# Altium project BH1730FVC_panel.PrjPcb
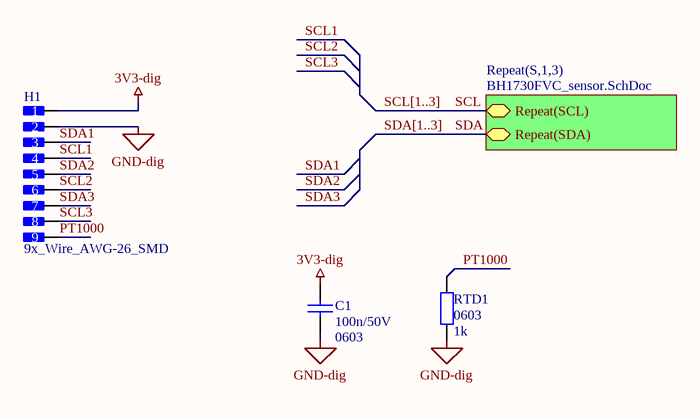
[diagram p0: BH1730FVC_top.SchDoc]
2 sheets, 6 parts. Net scope: hierarchical (ports join the sheet entries above them; power ports are global).
Board files: BH1730FVC_panel_with_PT1000_PCB.PcbDoc, BH1730FVC_panel_PCB.PcbDoc
Sheets:
  BH1730FVC_top.SchDoc
    S1 = BH1730FVC_sensor.SchDoc
    S2 = BH1730FVC_sensor.SchDoc
    S3 = BH1730FVC_sensor.SchDoc

## Sheet BH1730FVC_top.SchDoc: Electrical Power System - General Block Diagram
size A4; Date: 2015-02-21; CheckedBy: Piotr Kuligowski; Author: Michał Gumiela; DocumentNumber: 1; Revision: 1-0; SheetNumber: 1; SheetTotal: 2; Model: DM1; PageSetup: Record=PageOptions|CenterHorizontal=True|CenterVertical=True|PrintScale=0.52|XCorrection=1.00|YCorrection=1.00|PrintKind=1|BorderSize=5000000|LeftOffset=0|BottomOffset=0|Orientation=2|PaperLength=4200|PaperWidth=2970|Scale=100|PaperSource=7|PrintQuality=600|MediaType=1|DitherType=10|PaperKind=A3|PrintScaleMode=1

### Parts
C1  Package: 0603  [SMD_Capacitor_0603]  (hidden comment: 100n/50V)
H1  9x_Wire_AWG-26_SMD  [Wire_AWG-26_x9_SMD]
RTD1  Package: 0603  [SMD_Resistor_0603]  (hidden comment: 1k)

### Sub-sheets
Repeat(S,1,3) = BH1730FVC_sensor.SchDoc: Repeat(SCL) (bidir), Repeat(SDA) (bidir)

### Nets
3V3-dig: C1.1 H1.1
GND-dig: C1.2 H1.2 RTD1.2
PT1000: H1.9 RTD1.1
SCL: sheet Repeat(S,1,3)/Repeat(SCL)
SCL1: H1.4
SCL2: H1.6
SCL3: H1.8
SDA: sheet Repeat(S,1,3)/Repeat(SDA)
SDA1: H1.3
SDA2: H1.5
SDA3: H1.7

### Buses and harness runs
bus SCL[1..3]
bus SDA[1..3]

### Notes on the sheet
- Title:
- Sheet:
- of
- Author:
- Model:
- Document Number:
- Checked by:
- Iss-Rev:
- Approved by:
- Date:
- File name:

### Library data of the parts
C1 = Cer_C0603T104K5RALTU: Ceramic Cap Kemet COTS 100n/50V X7R 0603; Manufacturer: Kemet; ManufacturerPartNumber: C0603T104K5RALTU; Value: 100n/50V
H1 = Wire_AWG-26_x9_SMD_1: 9 x SMD pads for an AWG-26 wire with stress relief, pitch 1.27mm.; Value: 9x_Wire_AWG-26_SMD
RTD1 = PTS060301B100RP100: PT1000 Vishay PTS060301B100RP100; Manufacturer: Vishay; ManufacturerPartNumber: PTS060301B100RP100; Value: 1k

## Sheet BH1730FVC_sensor.SchDoc: BH1730FVC sensor sheet
size A4; Date: 2015-02-21; CheckedBy: Piotr Kuligowski; Author: Michał Gumiela; DocumentNumber: 2; Revision: 1-0; SheetNumber: 2; SheetTotal: 2; Model: DM1; PageSetup: Record=PageOptions|CenterHorizontal=True|CenterVertical=True|PrintScale=0.52|XCorrection=1.00|YCorrection=1.00|PrintKind=1|BorderSize=5000000|LeftOffset=0|BottomOffset=0|Orientation=2|PaperLength=4200|PaperWidth=2970|Scale=100|PaperSource=7|PrintQuality=600|MediaType=1|DitherType=10|PaperKind=A3|PrintScaleMode=1
Used 3 times, as channels S1, S2, S3. Parts and nets are listed once, with the designators drawn on the sheet.
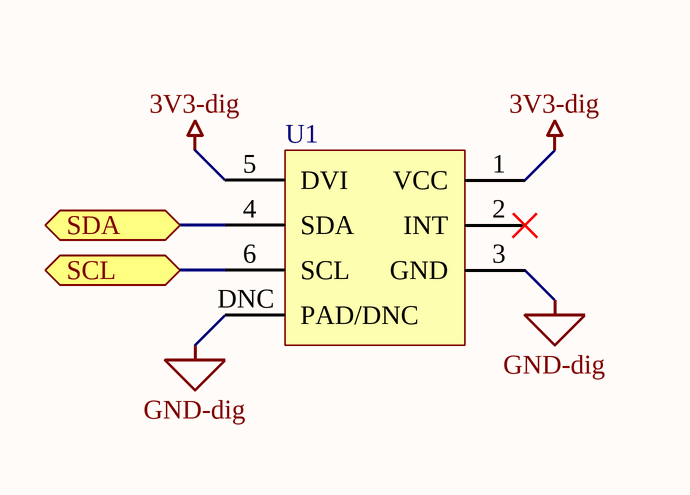
[diagram p1: BH1730FVC_sensor.SchDoc]

### Parts
U1  BH1730FVC  [WSOF6]

### Ports
SCL (bidir), SDA (bidir)

### Nets
3V3-dig: U1.1(VCC) U1.5(DVI)
GND-dig: U1.3(GND) U1.DNC(PAD/DNC)
SCL: U1.6(SCL) ; port SCL
SDA: U1.4(SDA) ; port SDA

Not connected (* = marked no-connect by the designer): U1 2(INT)*

### Channels
S1: designators end in _S1; ports SCL=SCL1 SDA=SDA1
S2: designators end in _S2; ports SCL=SCL2 SDA=SDA2
S3: designators end in _S3; ports SCL=SCL3 SDA=SDA3

### Notes on the sheet
- Title:
- Sheet:
- of
- Author:
- Model:
- Document Number:
- Checked by:
- Iss-Rev:
- Approved by:
- Date:
- File name:

### Library data of the parts
U1 = BH1730FVC: Digital 16bit Serial Output Type  Ambient Light Sensor IC; Manufacturer: ROHM; ManufacturerPartNumber: BH1730FVC

## Nets that join several sheets
3V3-dig: BH1730FVC_top (C1.1 H1.1), S1 (U1_S1.1 U1_S1.5), S2 (U1_S2.1 U1_S2.5), S3 (U1_S3.1 U1_S3.5)
GND-dig: BH1730FVC_top (C1.2 H1.2 RTD1.2), S1 (U1_S1.3 U1_S1.DNC), S2 (U1_S2.3 U1_S2.DNC), S3 (U1_S3.3 U1_S3.DNC)
SCL1: BH1730FVC_top (H1.4), S1 (U1_S1.6)
SCL2: BH1730FVC_top (H1.6), S2 (U1_S2.6)
SCL3: BH1730FVC_top (H1.8), S3 (U1_S3.6)
SDA1: BH1730FVC_top (H1.3), S1 (U1_S1.4)
SDA2: BH1730FVC_top (H1.5), S2 (U1_S2.4)
SDA3: BH1730FVC_top (H1.7), S3 (U1_S3.4)